# Altium schematic sheet ORD_CH341A.SchDoc
size 420 x 297 mm; Address1: Address1; Address2: Address2; Address3: Address3; Address4: Address4; DocumentNumber: АБВГ.123456.001 Э3; SheetNumber: 1; Scale: 1:1; DocumentType: Схема электрическая принципиальная; FirstReferrence: АБВГ.123456.001
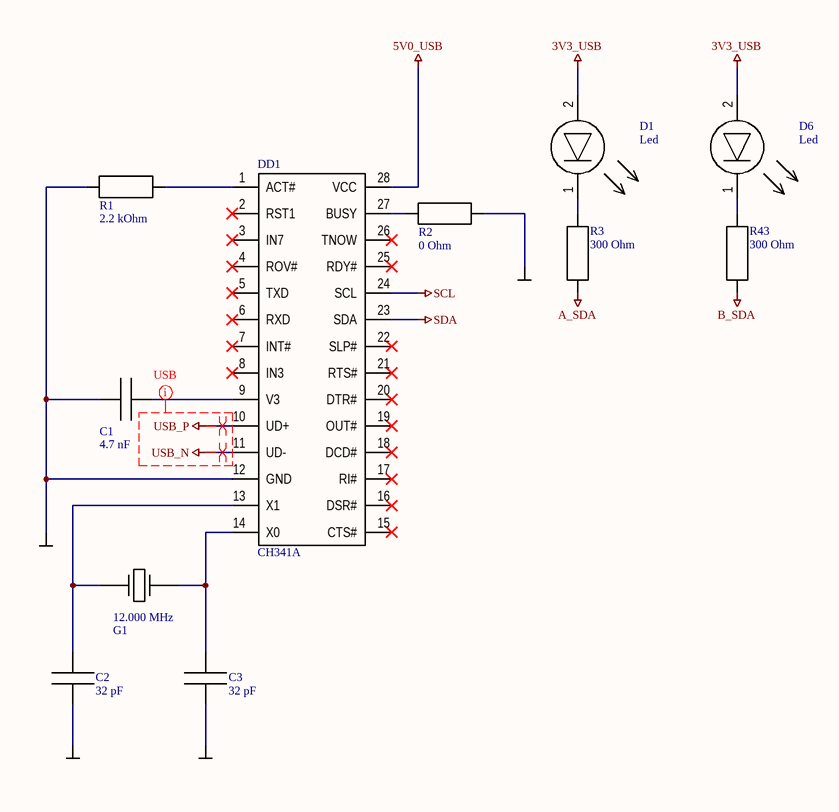
[diagram p0: ORD_CH341A.SchDoc]

## Parts
C1  4.7 nF  [C0603[1608]]
C2  32 pF  [C0603[1608]]
C3  32 pF  [C0603[1608]]
D1  Led  [LED_Blue_3mm_angled]
D6  Led  [LED_Red_3mm_angled]
DD1  CH341A  [SOIC28]
G1  12.000 MHz  [HC-49]
R1  2.2 kOhm  [R0603[1608]]
R2  0 Ohm  [R0603[1608]]
R3  300 Ohm  [R0603[1608]]
R43  300 Ohm  [R0603[1608]]

## Nets
3V3_USB: D1.2 D6.2
5V0_USB: DD1.28(VCC)
A_SDA: R3.1
B_SDA: R43.1
GND: C1.1 C2.1 C3.1 DD1.12(GND) R1.1 R2.2
SCL: DD1.24(SCL)
SDA: DD1.23(SDA)
USB_N: DD1.11(UD-)
USB_P: DD1.10(UD+)
NetC1_2: C1.2 DD1.9(V3)
NetC2_2: C2.2 DD1.13(X1) G1.1
NetC3_2: C3.2 DD1.14(X0) G1.2
NetD1_1: D1.1 R3.2
NetD6_1: D6.1 R43.2
NetDD1_1: DD1.1(ACT#) R1.2
NetDD1_27: DD1.27(BUSY) R2.1

Not connected (* = marked no-connect by the designer): DD1 2(RST1)* 3(IN7)* 4(ROV#)* 5(TXD)* 6(RXD)* 7(INT#)* 8(IN3)* 15(CTS#)* 16(DSR#)* 17(RI#)* 18(DCD#)* 19(OUT#)* 20(DTR#)* 21(RTS#)* 22(SLP#)* 25(RDY#)* 26(TNOW)*

## Layout directives
differential pair: USB_N, USB_P
net class USB: USB_N, USB_P

## Notes on the sheet
- Перв. примен.
- Справ. №
- Подп. и дата
- Инв. № дубл.
- Взам. инв. №
- Разраб.
- Изм.
- Лист
- № докум.
- Подп.
- Дата
- Лит.
- Масса
- Масштаб
- Пров.
- Т.контр.
- Листов
- Инв. № подл.
- Утв.
- Н.контр.
- 2.106-A3
- Копировал
- Формат А3

## Library data of the parts
C1-C3 = Capacitor: Manufacture: *; ManufacturerPartNumber: *; Power/Voltage: *; Quantity: *; Rem: *; TKE: *; Tolerance: *; Корпус: *; Примечание: *
  C1: Value: 4.7 nF
  C2 C3: Value: 32 pF
DD1 = CH341A: USB Bus Convert Chip CH341A; Manufacturer_Name: Spin Semiconductor; Manufacturer_Part_Number: FV-1 Reverb IC; Geometry.Height: 2.51mm; Mouser Part Number: *; Mouser Price/Stock: *; RS Part Number: *; RS Price/Stock: *; Datasheet Link: http://www.spinsemi.com/Products/datasheets/spn1001/FV-1.pdf
G1 = Crystal_2pin: Value: *
R1-R3 R43 = Resistor: Manufacture: *; ManufacturerPartNumber: *; Power/Voltage: *; Quantity: *; Rem: *; TKE: *; Tolerance: *; Корпус: *; Примечание: *
  R1: Value: 2.2 kOhm
  R2: Value: 0 Ohm
  R3 R43: Value: 300 Ohm
D1 D6 = Led: ManufacturerPartNumber: *